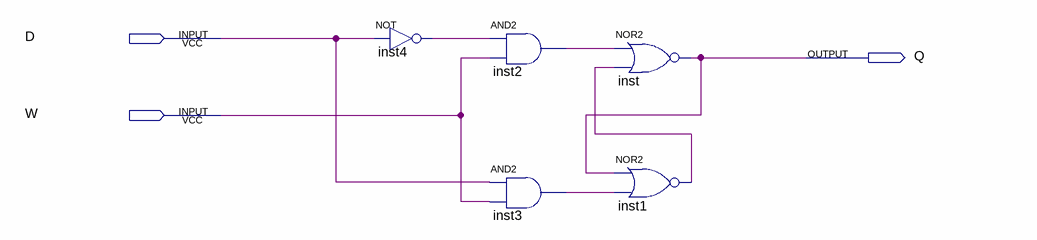
[diagram p0: schematic sheet]
// Quartus schematic myDlatchtest.bdf as structural Verilog: 5 symbols, 3 pins
module myDlatchtest (
  input  D,
  input  W,
  output Q
);

  wire inst1_out, inst2_out, inst3_out, inst4_out;

  not inst4 (inst4_out, D);
  and inst2 (inst2_out, inst4_out, W);
  and inst3 (inst3_out, D, W);
  nor inst (Q, inst2_out, inst1_out);
  nor inst1 (inst1_out, Q, inst3_out);
endmodule
